# EasyEDA Pro project RYDAPLink.epro

# Schematic RY-DAP_SCH
Create Date: 2022-08-28; Page Name: P1; Project Name: RY-DAP-online; Schematic Name: RY-DAP_SCH; Update Date: 2023-03-11; Add into BOM: yes; Convert to PCB: yes
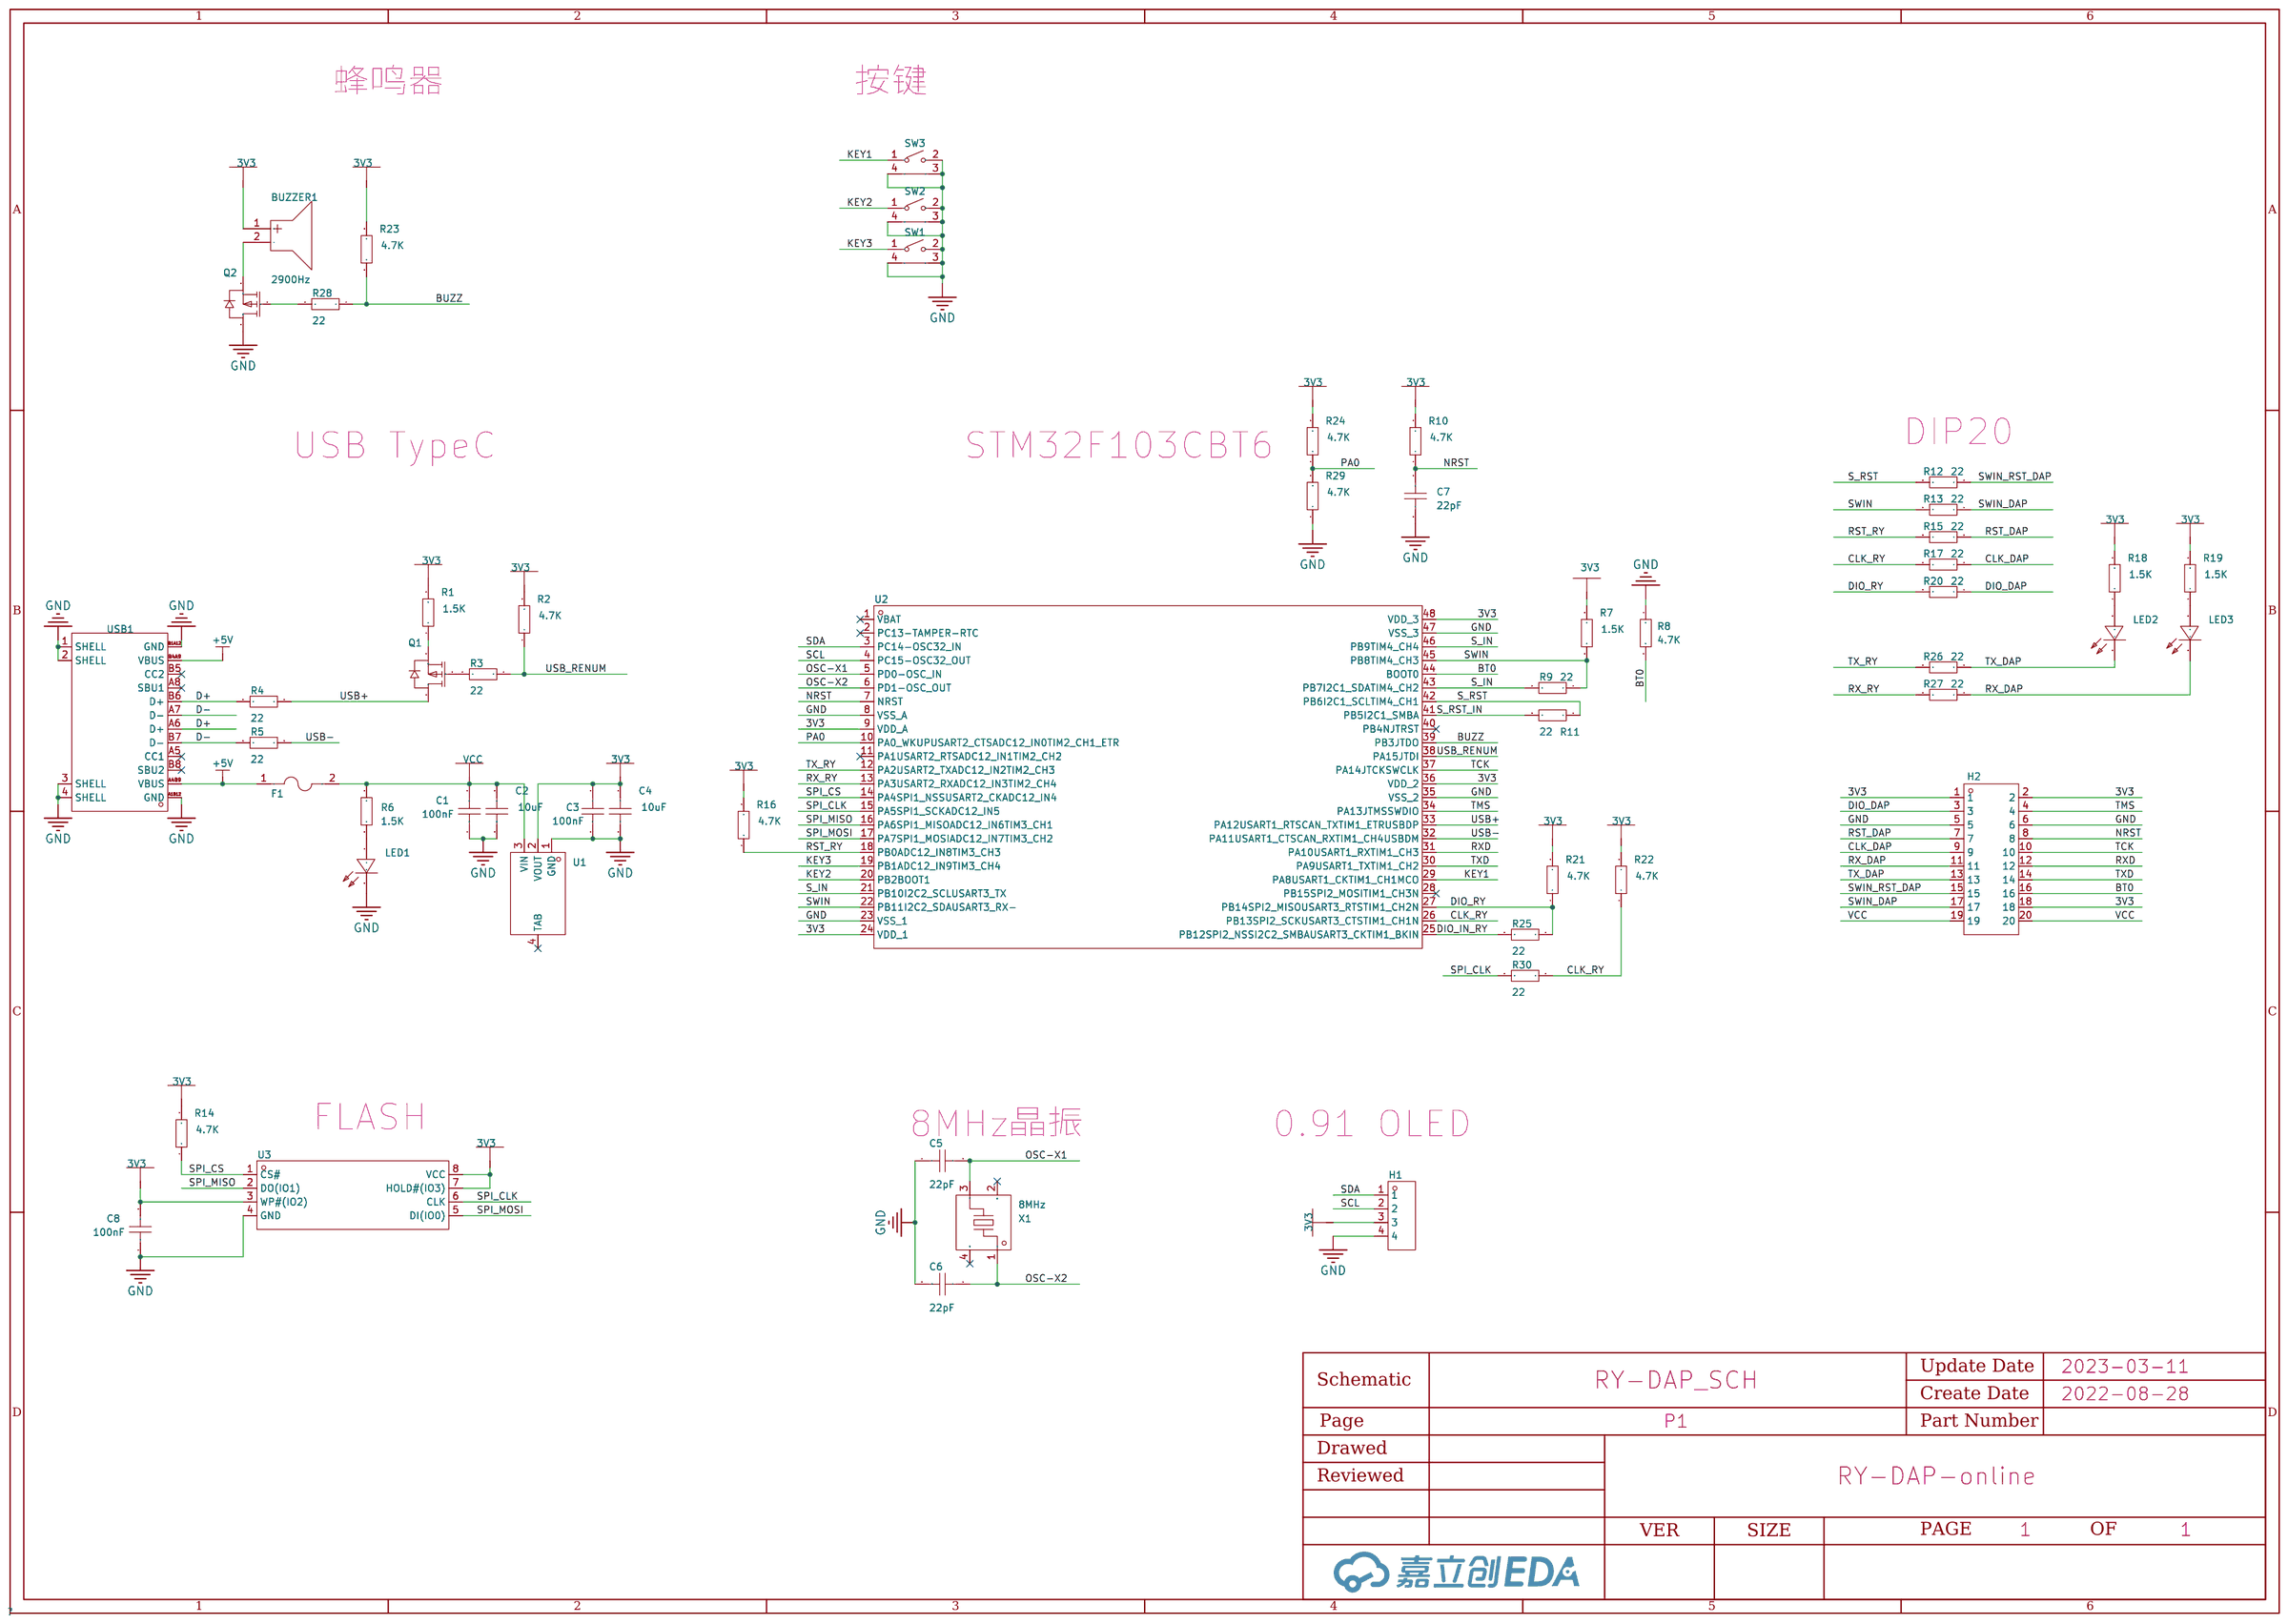
[diagram p0: schematic sheet]

## Parts
BUZZER1  2900Hz  [BUZ-TH_BD9.6-P5.00-D0.7-FD]
C1  100nF  [C0603]
C2  10uF  [C0805]
C3  100nF  [C0603]
C4  10uF  [C0805]
C5  22pF  [C0603]
C6  22pF  [C0603]
C7  22pF  [C0603]
C8  100nF  [C0603]
F1  -  [F0805]
H1  -  [HDR-TH_4P-P2.54-V-M]
H2  -  [HDR-TH_20P-P2.54-V-M-R2-C10-S2.54]
LED1  -  [LED0603-R-RD_RED]
LED2  -  [LED0603-R-RD_RED]
LED3  -  [LED0603-R-RD_RED]
Q1  -  [SOT-23-3_L2.9-W1.4-P1.90-LS2.6-BR]
Q2  -  [SOT-23-3_L2.9-W1.4-P1.90-LS2.6-BR]
R1  1.5K  [R0603]
R2  4.7K  [R0603]
R3  22  [R0603]
R4  22  [R0603]
R5  22  [R0603]
R6  1.5K  [R0603]
R7  1.5K  [R0603]
R8  4.7K  [R0603]
R9  22  [R0603]
R10  4.7K  [R0603]
R11  22  [R0603]
R12  22  [R0603]
R13  22  [R0603]
R14  4.7K  [R0603]
R15  22  [R0603]
R16  4.7K  [R0603]
R17  22  [R0603]
R18  1.5K  [R0603]
R19  1.5K  [R0603]
R20  22  [R0603]
R21  4.7K  [R0603]
R22  4.7K  [R0603]
R23  4.7K  [R0603]
R24  4.7K  [R0603]
R25  22  [R0603]
R26  22  [R0603]
R27  22  [R0603]
R28  22  [R0603]
R29  4.7K  [R0603]
R30  22  [R0603]
SW1  -  [SW-SMD_TS-1012A-AC05026]
SW2  -  [SW-SMD_TS-1012A-AC05026]
SW3  -  [SW-SMD_TS-1012A-AC05026]
U1  -  [SOT-223-3_L6.5-W3.4-P2.30-LS7.0-BR]
U2  -  [LQFP-48_L7.0-W7.0-P0.50-LS9.0-BL]
U3  -  [SOIC-8_L5.3-W5.3-P1.27-LS8.0-BL]
USB1  -  [USB-C-SMD_G-SWITCH_GT-USB-7010EN]
X1  8MHz  [CRYSTAL-SMD_4P-L3.2-W2.5-BL]

## Library data of the parts
BUZZER1 = Cy-9650-3029: 驱动方式:有源(内含驱动线路);构造类型:电磁式;额定电压:3V;工作电压:2V~4V;频率:2900Hz;声压(SPL):85dB@3V,10cm;直径(φD):9.6mm;高度:5.2mm;; LCSC Part Name: 电磁式有源蜂鸣器; Supplier Part: C200212; Manufacturer: CY(超音); Supplier Footprint: 插件; JLCPCB Part Class: Extended Part; Datasheet: https://atta.szlcsc.com/upload/public/pdf/source/20180420/C200212_F1CED36530D3A11649FCF5A8082FE34C.pdf; Supplier: LCSC; Oscillator Circuit: 有源(内含驱动线路); Technology Type: 电磁式; Rated Voltage: 3V; Operating Voltage: 2V~4V; Sound Pressure Level (SPL): 85dB@3V,10cm; Diameter (φD): 9.6mm; Height: 5.2mm
C1 C3 C8 = CC0603KRX7R9BB104: 容值:100nF;精度:±10%;额定电压:50V;温度系数:X7R;; LCSC Part Name: 100nF ±10% 50V; Supplier Part: C14663; Manufacturer: YAGEO(国巨); Supplier Footprint: 0603; JLCPCB Part Class: Basic Part; Datasheet: https://atta.szlcsc.com/upload/public/pdf/source/20170116/1484561234239.pdf; Supplier: LCSC; Tolerance: ±10%; Voltage Rated: 50V; Temperature Coefficient: X7R
C2 C4-C7 = CC0805FRNPO9BN330: 容值:33pF;精度:±1%;额定电压:50V;温度系数:NP0;; LCSC Part Name: 33pF ±1% 50V; Supplier Part: C541516; Manufacturer: YAGEO(国巨); Supplier Footprint: 0805; JLCPCB Part Class: Extended Part; Datasheet: https://atta.szlcsc.com/upload/public/pdf/source/20200615/C541516_87B4F5CEA473EFDDBB2B4786DAFFF3AA.pdf; Supplier: LCSC; Tolerance: ±1%; Voltage Rated: 50V; Temperature Coefficient: NP0
F1 = ASMD0805-075: 最大电压:6V;最大电流:40A;保持电流:750mA;跳闸电流:1.5A;消耗功率:600mW;初始态阻值(最小值):90mΩ;跳断后阻值(最大值):385mΩ;最大动作时间:200ms;工作温度:-40~+85;; LCSC Part Name: 0.75A 自恢复; Supplier Part: C135330; Manufacturer: JDTfuse集电通; Supplier Footprint: 0805; JLCPCB Part Class: Extended Part; Datasheet: https://atta.szlcsc.com/upload/public/pdf/source/20171014/C135330_15079756464341038401.pdf; Supplier: LCSC; Operating Voltage (Max): 6V; Current Rating (Max): 40A; Hold Current: 750mA; Trip Current: 1.5A; Power Dissipation: 600mW; Resistance - Initial (Ri) (Min): 90mΩ; Resistance - Post Trip (R1) (Max): 385mΩ; Maximum Time to Trip: 200ms; Operating Temperature: -40~+85
H1 = KH-2.54PH180-1X4P-L11.5: 间距:2.54mm;总PIN位数:4;排数:1;插针结构:1x4P;行距:-;安装类型:直插;圆针/方针:方针;额定电流:3A;额定电压:-;配合针长度:6mm;塑高:2.5mm;端接针长度:3mm;触头材质:-;工作温度范围:-40~+105;颜色:黑色;; LCSC Part Name: 2.54mm 1x4P; Supplier Part: C2905435; Manufacturer: kinghelm(金航标); Supplier Footprint: 插件,P=2.54mm; JLCPCB Part Class: Extended Part; Datasheet: https://atta.szlcsc.com/upload/public/pdf/source/20211019/06FD9EA041E66F176E900F61FE678D35.pdf; Supplier: LCSC; Pitch: 2.54mm; Number of Pins: 4; Number of Rows: 1; Pin Structure: 1x4P; Mounting Type: 直插; Circluar Pins/Square Pins: 方针; Current Rating (Max): 3A; Length of Mating Pin: 6mm; Insulation Height: 2.5mm; Length of End Connection Pin: 3mm; Operating Temperature Range: -40~+105; Color: 黑色
H2 = 1125-1210G0S120C002: 间距:2.54mm;总PIN位数:20;排数:2;插针结构:2x10P;行距:2.54mm;安装类型:直插;圆针/方针:方针;额定电流:3A;额定电压:-;配合针长度:-;塑高:2.5mm;端接针长度:-;工作温度范围:-40~+105;颜色:黑色;; LCSC Part Name: 2x10P 间距P=2.54mm; Supplier Part: C920775; Manufacturer: Wcon(维峰电子); Supplier Footprint: 插件,P=2.54mm; Datasheet: https://atta.szlcsc.com/upload/public/pdf/source/20211202/DE12C641305AA727218726D917D75D7F.pdf; Supplier: LCSC; Pitch: 2.54mm; Number of Pins: 20; Number of Rows: 2; Pin Structure: 2x10P; Row Spacing: 2.54mm; Mounting Type: 直插; Circluar Pins/Square Pins: 方针; Current Rating (Max): 3A; Insulation Height: 2.5mm; Operating Temperature Range: -40~+105; Color: 黑色
LED1-LED3 = NCD0603R3: 尺寸1.6x0.8x0.8；IF=20ma：1.6~2.6v，620~640nm,51~150mcd金线，光强高，功耗低，可靠性好，寿命长; LCSC Part Name: 红色;贴片LED;0603红灯;; Supplier Part: C3151730; Manufacturer: 国星光电; Supplier Footprint: 0603; JLCPCB Part Class: Extended Part; Datasheet: https://atta.szlcsc.com/upload/public/pdf/source/20220704/CBFF28C1847A97213A75929E60B7DDE7.pdf; Supplier: LCSC
Q1 Q2 = AO3401: 类型:-;漏源电压(Vdss):-;连续漏极电流(Id):-;功率(Pd):-;导通电阻(RDS(on)@Vgs,Id):-;阈值电压(Vgs(th)@Id):-;栅极电荷(Qg@Vgs):-;输入电容(Ciss@Vds):-;反向传输电容(Crss@Vds):-;; Supplier Part: C727156; Manufacturer: TWGMC(台湾迪嘉); Supplier Footprint: SOT-23; JLCPCB Part Class: Extended Part; Datasheet: https://atta.szlcsc.com/upload/public/pdf/source/20200827/C727156_6E081BBEEFBC6B8FEE164CB196B0AF30.pdf; Supplier: LCSC
R1-R30 = TR0603B10K0P0525Z: 电阻类型:薄膜电阻;阻值:10kΩ;精度:±0.1%;功率:100mW;温度系数:±25ppm/;最大工作电压:75V;工作温度范围:-55~+155;; LCSC Part Name: 10kΩ ±0.1% 100mW; Supplier Part: C188363; Manufacturer: EVER OHMS(天二科技); Supplier Footprint: 0603; JLCPCB Part Class: Extended Part; Datasheet: https://atta.szlcsc.com/upload/public/pdf/source/20190415/C188363_433BF05B6FB8F7A0F5F35A3E4390C55A.pdf; Supplier: LCSC; Type: 薄膜电阻; Tolerance: ±0.1%; Power(Watts): 100mW; Temperature Coefficient: ±25ppm/; Overload Voltage (Max): 75V; Operating Temperature Range: -55~+155
SW1-SW3 = TS-1012A-AC05026: 触点电流:50mA;额定电压(DC):12V;绝缘电阻:100MΩ;电路结构:单刀单掷;安装方式:卧贴;按钮形状:矩形按钮;按钮/盖帽颜色:白色;作用力:260gf@±50gf;机械寿命:50000;工作温度:-30~+80;引脚样式:SMD接片;开关长度:6mm;开关宽度:3.6mm;开关高度:5mm;带支架:否;; LCSC Part Name: 365.0 260gf 侧按轻触开关; Supplier Part: C720456; Manufacturer: XUNPU(讯普); Supplier Footprint: SMD; JLCPCB Part Class: Extended Part; Datasheet: https://atta.szlcsc.com/upload/public/pdf/source/20200810/C720456_D958E12D1FC8757B1EE5C4C24011CAC5.pdf; Supplier: LCSC; Contact Current: 50mA; Voltage Rating (DC): 12V; Insulation Resistance: 100MΩ; Circuit: 单刀单掷; Mounting Style: 卧贴; Actuator Style: 矩形按钮; Actuator/Cap Color: 白色; Operating Force: 260gf@±50gf; Mechanical Life: 50000; Operating Temperature: -30~+80; Pin Style: SMD接片; Switch Length: 6mm; Switch Width: 3.6mm; Switch Height: 5mm; Strike Gundam: 否
U1 = AMS1117-3.3: 输出类型:固定;输出极性:正;输出通道数:1;最大输入电压:18V;输出电压:3.3V;压差:1.4V@(1A);输出电流:800mA;电源纹波抑制比(PRSS):-;; LCSC Part Name: Vin=18V Vout=3.3V 800mA; Supplier Part: C351784; Manufacturer: PUOLOP(迪浦); Supplier Footprint: SOT-223; JLCPCB Part Class: Extended Part; Datasheet: https://atta.szlcsc.com/upload/public/pdf/source/20210915/EA806799CEEC3F52E0A4FA8303A508AC.pdf; Supplier: LCSC; Output Type: 固定; Output Polarity: 正; Number of Outputs: 1; Maximum Input Voltage: 18V; Output Voltage: 3.3V; Dropout Voltage: 1.4V@(1A); Output Current: 800mA
U2 = STM32F103CBT6: 主频（MAX):72MHz;工作电压:2V ~ 3.6V;; Supplier Part: C8304; Manufacturer: ST(意法半导体); Supplier Footprint: LQFP-48_7x7x05P; JLCPCB Part Class: Extended Part; Datasheet: https://atta.szlcsc.com/upload/public/pdf/source/20140724/1457707170379.pdf; Supplier: LCSC; Speed: 72MHz; Voltage - Supply (Vcc/Vdd): 2V ~ 3.6V; RAM Size: 20KB; Number of I/O: 37; A/D: 16x12bit; PWM: 13; UART/USART: 3 USART; I2C（SMBUS/PMBUS）: 2; USB Device: 1; CAN: 1
U3 = W25Q64FVSSIQ: Supplier Part: C2943203; Manufacturer: WINBOND(华邦); Supplier Footprint: SOIC-8; JLCPCB Part Class: Extended Part; Datasheet: https://atta.szlcsc.com/upload/public/pdf/source/20220124/B586DF8D2E26F9242C002B2D869830EA.pdf; Supplier: LCSC
USB1 = HC-TYPE-C-16P-01A-R: 连接器类型:Type-C;公母:母座;触点数量:16;端口数量:1;安装方式:卧贴;; LCSC Part Name: Type-C 母座 卧贴; Supplier Part: C2997433; Manufacturer: HCTL(华灿天禄); Supplier Footprint: SMD; Datasheet: https://atta.szlcsc.com/upload/public/pdf/source/20220415/23B51DCADC5F28223C40C3605487ACA1.pdf; Supplier: LCSC; Connector Type: Type-C; Gender: 母座; Number of Contacts: 16; Number of Ports: 1; Mounting Style: 卧贴
X1 = C3SB8.000F20E12: 晶振类型:-;频率:-;频率公差:-;频率稳定度:-;负载电容:-;工作温度:-;; LCSC Part Name: SMD3225 8MHz 20pF ±10ppm; Supplier Part: C1122371; Manufacturer: 川晶科技; Supplier Footprint: SMD3225-4P; JLCPCB Part Class: Extended Part; Datasheet: https://atta.szlcsc.com/upload/public/pdf/source/20201223/C1122371_97DFC19ADA5624E5F21B86C96BD1463C.pdf; Supplier: LCSC

## Nets
3V3: BUZZER1.1(+) C3.1 C4.2 C8.2 H1.3 H2.1 H2.2 H2.18 R1.2 R2.2 R7.2 R10.2 R14.2 R16.2 R18.2 R19.2 R21.2 R22.2 R23.2 R24.2 U1.2(VOUT) U2.9(VDD_A) U2.24(VDD_1) U2.36(VDD_2) U2.48(VDD_3) U3.3(WP#(IO2)) U3.7(HOLD#(IO3)) U3.8(VCC)
+5V: F1.1 USB1.A4B9(VBUS) USB1.B4A9(VBUS)
GND: C1.1 C2.1 C3.2 C4.1 C5.1 C6.2 C7.2 C8.1 H1.4 H2.5 H2.6 LED1.2(K) Q2.3(D) R8.1 R29.1 SW1.2 SW1.3 SW1.4 SW2.2 SW2.3 SW2.4 SW3.2 SW3.3 SW3.4 U1.1(GND) U2.8(VSS_A) U2.23(VSS_1) U2.35(VSS_2) U2.47(VSS_3) U3.4(GND) USB1.1(SHELL) USB1.2(SHELL) USB1.3(SHELL) USB1.4(SHELL) USB1.A1B12(GND) USB1.B1A12(GND)
VCC: C1.2 C2.2 F1.2 H2.19 H2.20 R6.1 U1.3(VIN)
BT0: H2.16 R8.2 U2.44(BOOT0)
BUZZ: R23.1 R28.1 U2.39(PB3JTDO)
CLK_DAP: H2.9 R17.1
CLK_RY: R17.2 R22.1 R30.1 U2.26(PB13SPI2_SCKUSART3_CTSTIM1_CH1N)
D+: R4.2 USB1.A6(D+) USB1.B6(D+)
D-: R5.2 USB1.A7(D-) USB1.B7(D-)
DIO_DAP: H2.3 R20.1
DIO_IN_RY: R25.2 U2.25(PB12SPI2_NSSI2C2_SMBAUSART3_CKTIM1_BKIN)
DIO_RY: R20.2 R21.1 R25.1 U2.27(PB14SPI2_MISOUSART3_RTSTIM1_CH2N)
KEY1: SW3.1 U2.29(PA8USART1_CKTIM1_CH1MCO)
KEY2: SW2.1 U2.20(PB2BOOT1)
KEY3: SW1.1 U2.19(PB1ADC12_IN9TIM3_CH4)
NRST: C7.1 H2.8 R10.1 U2.7(NRST)
OSC-X1: C5.2 U2.5(PD0-OSC_IN) X1.3
OSC-X2: C6.1 U2.6(PD1-OSC_OUT) X1.1
PA0: R24.1 R29.2 U2.10(PA0_WKUPUSART2_CTSADC12_IN0TIM2_CH1_ETR)
RST_DAP: H2.7 R15.1
RST_RY: R15.2 R16.1 U2.18(PB0ADC12_IN8TIM3_CH3)
RX_DAP: H2.11 LED3.2(K) R27.1
RX_RY: R27.2 U2.13(PA3USART2_RXADC12_IN3TIM2_CH4)
RXD: H2.12 U2.31(PA10USART1_RXTIM1_CH3)
S_IN: R9.2 U2.21(PB10I2C2_SCLUSART3_TX) U2.43(PB7I2C1_SDATIM4_CH2) U2.46(PB9TIM4_CH4)
S_RST: R11.1 R12.2 U2.42(PB6I2C1_SCLTIM4_CH1)
S_RST_IN: R11.2 U2.41(PB5I2C1_SMBA)
SCL: H1.2 U2.4(PC15-OSC32_OUT)
SDA: H1.1 U2.3(PC14-OSC32_IN)
SPI_CLK: R30.2 U2.15(PA5SPI1_SCKADC12_IN5) U3.6(CLK)
SPI_CS: R14.1 U2.14(PA4SPI1_NSSUSART2_CKADC12_IN4) U3.1(CS#)
SPI_MISO: U2.16(PA6SPI1_MISOADC12_IN6TIM3_CH1) U3.2(DO(IO1))
SPI_MOSI: U2.17(PA7SPI1_MOSIADC12_IN7TIM3_CH2) U3.5(DI(IO0))
SWIN: R7.1 R9.1 R13.2 U2.22(PB11I2C2_SDAUSART3_RX-) U2.45(PB8TIM4_CH3)
SWIN_DAP: H2.17 R13.1
SWIN_RST_DAP: H2.15 R12.1
TCK: H2.10 U2.37(PA14JTCKSWCLK)
TMS: H2.4 U2.34(PA13JTMSSWDIO)
TX_DAP: H2.13 LED2.2(K) R26.1
TX_RY: R26.2 U2.12(PA2USART2_TXADC12_IN2TIM2_CH3)
TXD: H2.14 U2.30(PA9USART1_TXTIM1_CH2)
USB+: Q1.3(D) R4.1 U2.33(PA12USART1_RTSCAN_TXTIM1_ETRUSBDP)
USB-: R5.1 U2.32(PA11USART1_CTSCAN_RXTIM1_CH4USBDM)
USB_RENUM: R2.1 R3.1 U2.38(PA15JTDI)
$1N17432: Q2.1(G) R28.2
$1N18058: BUZZER1.2(-) Q2.2(S)
$1N29748: Q1.1(G) R3.2
$1N30353: LED1.1(A) R6.2
$1N32779: LED2.1(A) R18.1
$1N32941: LED3.1(A) R19.1
$1N52771: Q1.2(S) R1.1

Not connected (* = marked no-connect by the designer): U1 4(TAB)*; U2 1(VBAT)* 2(PC13-TAMPER-RTC)* 11(PA1USART2_RTSADC12_IN1TIM2_CH2)* 28(PB15SPI2_MOSITIM1_CH3N)* 40(PB4NJTRST)*; USB1 A5(CC1)* A8(SBU1)* B5(CC2)* B8(SBU2)*; X1 2(GND)* 4(GND)*

## Notes on the sheet
- 蜂鸣器
- 按键
- DIP20
- USB TypeC
- STM32F103CBT6
- FLASH
- 8MHz晶振
- 0.91 OLED

# Board RY-DAP_PCB
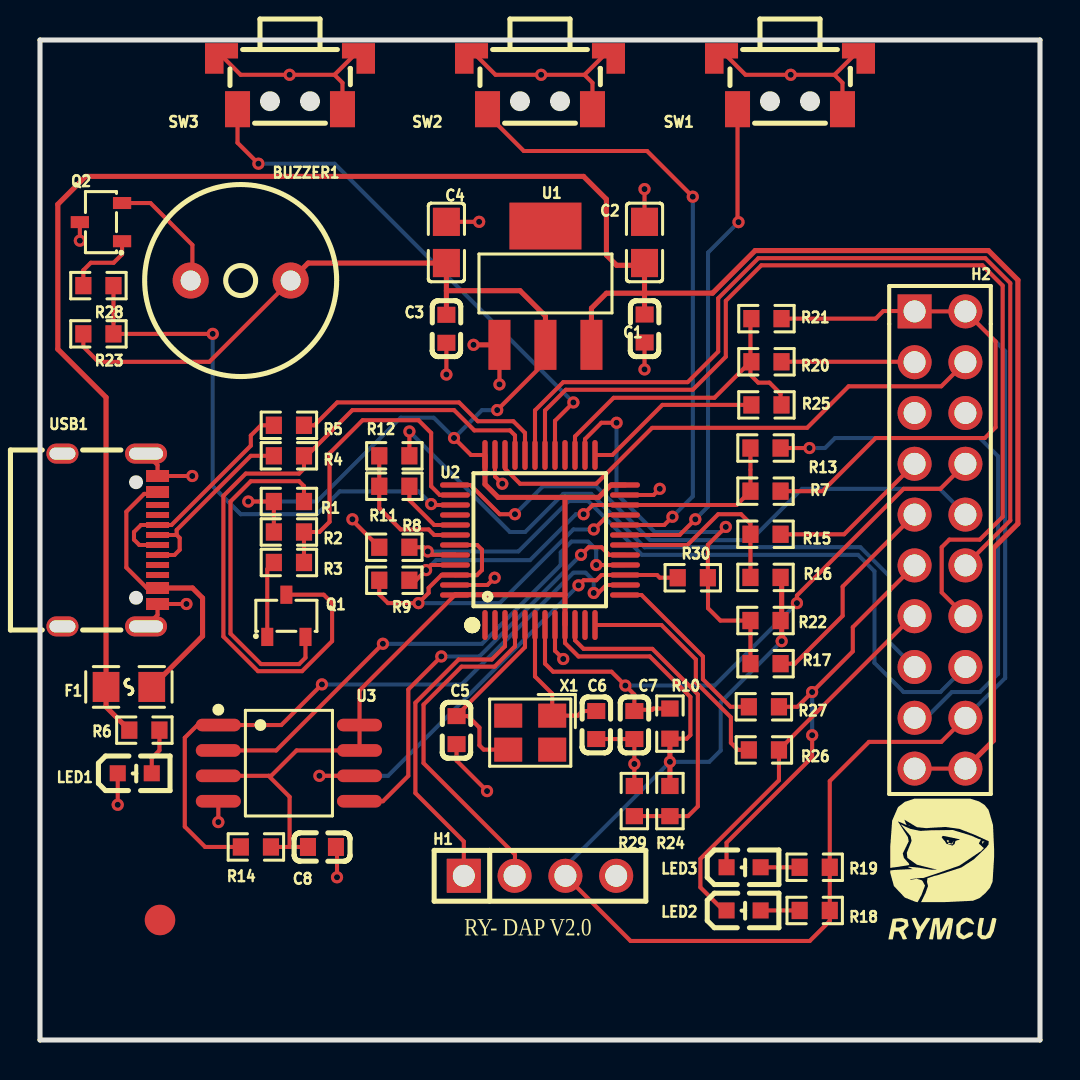
[diagram p1: board, top side]
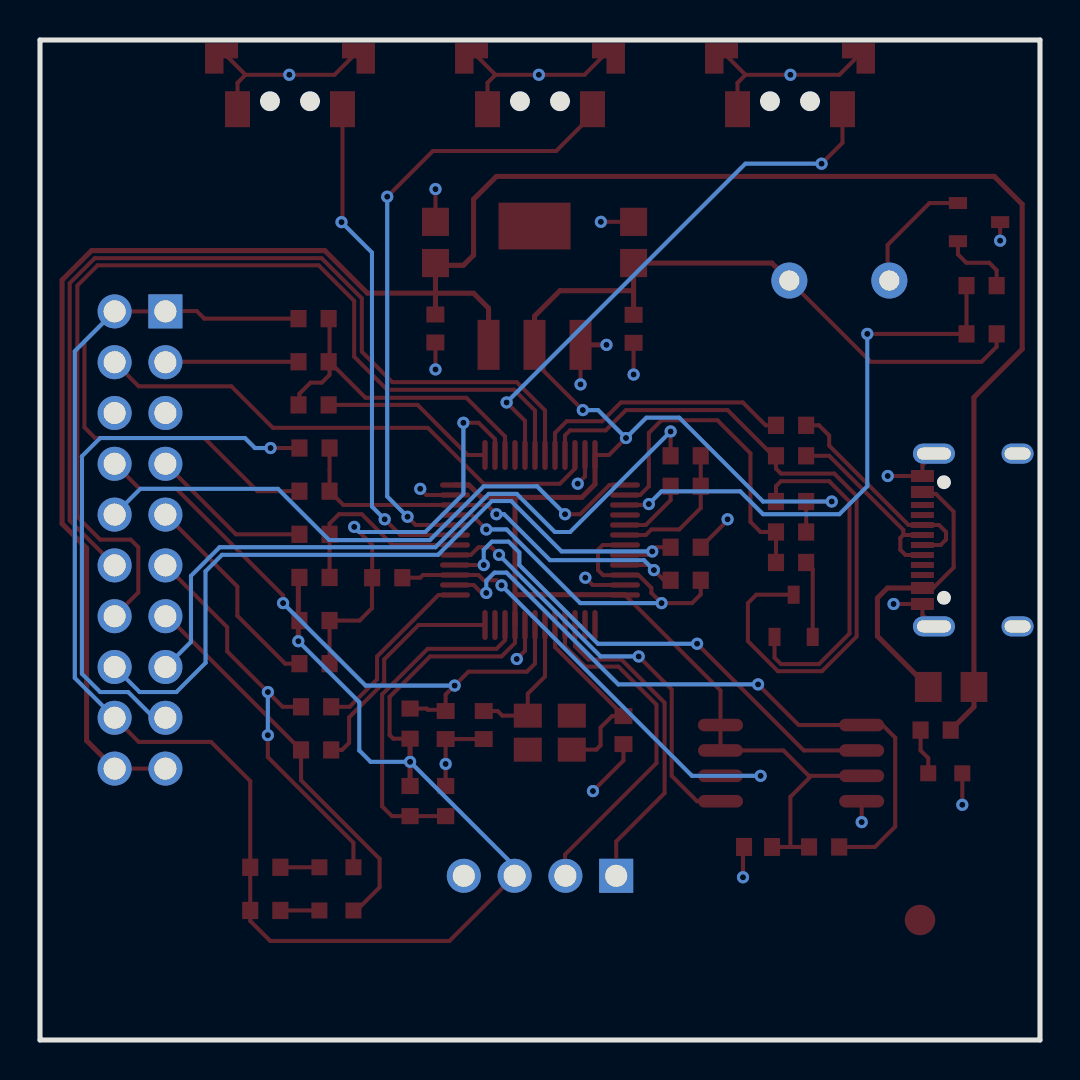
[diagram p2: board, bottom side, seen from below]

Outline 50 x 50 mm; copper layers: Top Layer, Bottom Layer. Coordinates in mm from the lower left corner of the outline.
Outline path: 0,50 0,0 50,0 50,50 0,50
Stack: Top Layer 0.035mm / Dielectric1 1.51mm FR4 er 4.5 / Bottom Layer 0.035mm

## Design rules (mm)
spacing safeClearance (default): track to track 0.152, other pairs 0.147 to 0.3
track width trackWidth (default): min 0.127, default 0.203, max 2.54
differential pair differentialPair (default): width min 0.127, default 0.254, max 2.54; gap min 0.152, default 0.152
via viaSize (default): diameter min 0.5, default 0.61, max 10; hole min 0.3, default 0.305, max 6

## Placement (name value [footprint] x y rotation side)
BUZZER1  2900Hz  [BUZ-TH_BD9.6-P5.00-D0.7-FD]  10.03 37.97 180 top
C1  100nF  [C0603]  30.23 35.58 90 top
C2  10uF  [C0805]  30.23 39.88 270 top
C3  100nF  [C0603]  20.32 35.56 270 top
C4  10uF  [C0805]  20.32 39.88 270 top
C5  22pF  [C0603]  20.83 15.49 90 top
C6  22pF  [C0603]  27.81 15.75 270 top
C7  22pF  [C0603]  29.72 15.75 270 top
C8  100nF  [C0603]  14.1 9.65 180 top
F1  -  [F0805]  4.44 17.65 180 top
H1  -  [HDR-TH_4P-P2.54-V-M]  25 8.21 0 top
H2  -  [HDR-TH_20P-P2.54-V-M-R2-C10-S2.54]  45 25 270 top
LED1  -  [LED0603-R-RD_RED]  4.74 13.34 0 top
LED2  -  [LED0603-R-RD_RED]  35.18 6.48 0 top
LED3  -  [LED0603-R-RD_RED]  35.18 8.64 0 top
NOREF  -  [Pad_e1074]  6 6 0 top
Q1  -  [SOT-23-3_L2.9-W1.4-P1.90-LS2.6-BR]  12.32 21.21 270 top
Q2  -  [SOT-23-3_L2.9-W1.4-P1.90-LS2.6-BR]  3.05 40.89 0 top
R1  1.5K  [R0603]  12.45 26.92 180 top
R2  4.7K  [R0603]  12.45 25.4 180 top
R3  22  [R0603]  12.45 23.88 180 top
R4  22  [R0603]  12.45 29.21 180 top
R5  22  [R0603]  12.45 30.73 180 top
R6  1.5K  [R0603]  5.22 15.49 0 top
R7  1.5K  [R0603]  36.28 27.44 0 top
R8  4.7K  [R0603]  17.72 24.64 0 top
R9  22  [R0603]  17.72 22.99 180 top
R10  4.7K  [R0603]  31.5 15.82 270 top
R11  22  [R0603]  17.72 27.69 0 top
R12  22  [R0603]  17.72 29.21 180 top
R13  22  [R0603]  36.28 29.6 180 top
R14  4.7K  [R0603]  10.8 9.65 0 top
R15  22  [R0603]  36.28 25.29 180 top
R16  4.7K  [R0603]  36.28 23.13 0 top
R17  22  [R0603]  36.28 18.82 180 top
R18  1.5K  [R0603]  38.74 6.48 0 top
R19  1.5K  [R0603]  38.74 8.64 0 top
R20  22  [R0603]  36.32 33.91 180 top
R21  4.7K  [R0603]  36.32 36.07 0 top
R22  4.7K  [R0603]  36.28 20.97 0 top
R23  4.7K  [R0603]  2.92 35.31 180 top
R24  4.7K  [R0603]  31.5 11.95 90 top
R25  22  [R0603]  36.32 31.76 180 top
R26  22  [R0603]  36.19 14.5 180 top
R27  22  [R0603]  36.19 16.66 180 top
R28  22  [R0603]  2.92 37.72 180 top
R29  4.7K  [R0603]  29.72 11.95 270 top
R30  22  [R0603]  32.64 23.11 180 top
SW1  -  [SW-SMD_TS-1012A-AC05026]  37.5 48 0 top
SW2  -  [SW-SMD_TS-1012A-AC05026]  25 48 0 top
SW3  -  [SW-SMD_TS-1012A-AC05026]  12.5 48 0 top
U1  -  [SOT-223-3_L6.5-W3.4-P2.30-LS7.0-BR]  25.27 37.73 270 top
U2  -  [LQFP-48_L7.0-W7.0-P0.50-LS9.0-BL]  25 25 0 top
U3  -  [SOIC-8_L5.3-W5.3-P1.27-LS8.0-BL]  12.45 13.84 270 top
USB1  -  [USB-C-SMD_G-SWITCH_GT-USB-7010EN]  3.5 25 270 top
X1  8MHz  [CRYSTAL-SMD_4P-L3.2-W2.5-BL]  24.51 15.37 180 top

## Footprints (pads in the part's own frame, mm; a bottom-side part is the same pattern mirrored in y, then rotated)
BUZ-TH_BD9.6-P5.00-D0.7-FD
  round 1.801 hole 1.001: 1(-2.499,0) 2(2.499,0)
C0603
  rect 0.8x0.9 smd: 1(-0.7,0) 2(0.7,0)
C0805
  rect 1.41x1.35 smd: 1(-1.03,0) 2(1.03,0)
CRYSTAL-SMD_4P-L3.2-W2.5-BL
  rect 1.4x1.2 smd: 1(-1.1,-0.85) 2(1.1,-0.85) 3(1.1,0.85) 4(-1.1,0.85)
F0805
  rect 1.335x1.5 smd: 1(-1.143,0) 2(1.143,0)
HDR-TH_4P-P2.54-V-M
  rect 1.7x1.7 hole 1.1: 1(-3.81,0)
  round 1.7 hole 1.1: 2(-1.27,0) 3(1.27,0) 4(3.81,0)
HDR-TH_20P-P2.54-V-M-R2-C10-S2.54
  rect 1.7x1.7 hole 1.1: 1(-11.43,-1.27)
  round 1.7 hole 1.1: 2(-11.43,1.27) 3(-8.89,-1.27) 4(-8.89,1.27) 5(-6.35,-1.27) 6(-6.35,1.27) 7(-3.81,-1.27) 8(-3.81,1.27) 9(-1.27,-1.27) 10(-1.27,1.27) 11(1.27,-1.27) 12(1.27,1.27) 13(3.81,-1.27) 14(3.81,1.27) 15(6.35,-1.27) 16(6.35,1.27) 17(8.89,-1.27) 18(8.89,1.27) 19(11.43,-1.27) 20(11.43,1.27)
LED0603-R-RD_RED
  rect 0.8x0.8 smd: 1(0.851,0) 2(-0.851,0)
LQFP-48_L7.0-W7.0-P0.50-LS9.0-BL
  oval 0.27x1.5 smd: 1(-2.75,-4.25) 2(-2.25,-4.25) 3(-1.75,-4.25) 4(-1.25,-4.25) 5(-0.75,-4.25) 6(-0.25,-4.25) 7(0.25,-4.25) 8(0.75,-4.25) 9(1.25,-4.25) 10(1.75,-4.25) 11(2.25,-4.25) 12(2.75,-4.25) 25(2.75,4.25) 26(2.25,4.25) 27(1.75,4.25) 28(1.25,4.25) 29(0.75,4.25) 30(0.25,4.25) 31(-0.25,4.25) 32(-0.75,4.25) 33(-1.25,4.25) 34(-1.75,4.25) 35(-2.25,4.25) 36(-2.75,4.25)
  oval 1.5x0.27 smd: 13(4.25,-2.75) 14(4.25,-2.25) 15(4.25,-1.75) 16(4.25,-1.25) 17(4.25,-0.75) 18(4.25,-0.25) 19(4.25,0.25) 20(4.25,0.75) 21(4.25,1.25) 22(4.25,1.75) 23(4.25,2.25) 24(4.25,2.75) 37(-4.25,2.75) 38(-4.25,2.25) 39(-4.25,1.75) 40(-4.25,1.25) 41(-4.25,0.75) 42(-4.25,0.25) 43(-4.25,-0.25) 44(-4.25,-0.75) 45(-4.25,-1.25) 46(-4.25,-1.75) 47(-4.25,-2.25) 48(-4.25,-2.75)
Pad_e1074
  round 1.524 smd: 1(0,0)
R0603
  rect 0.806x0.864 smd: 1(-0.753,0) 2(0.753,0)
SOIC-8_L5.3-W5.3-P1.27-LS8.0-BL
  oval 0.63x2.25 smd: 1(-1.905,-3.53) 2(-0.635,-3.53) 3(0.635,-3.53) 4(1.905,-3.53) 5(1.905,3.53) 6(0.635,3.53) 7(-0.635,3.53) 8(-1.905,3.53)
SOT-23-3_L2.9-W1.4-P1.90-LS2.6-BR
  rect 0.91x0.6 smd: 1(1.055,-0.955) 2(1.055,0.955) 3(-1.055,0)
SOT-223-3_L6.5-W3.4-P2.30-LS7.0-BR
  rect 2.5x1.1 smd: 1(2.97,-2.3) 2(2.97,0) 3(2.97,2.3)
  rect 2.34x3.6 smd: 4(-2.97,0)
SW-SMD_TS-1012A-AC05026
  rect 1.25x1.801 smd: 1(-2.624,-1.46) 2(2.624,-1.46)
  custom 1.651x1.524 smd: 3(3.424,1.46) 4(-3.424,1.46)
USB-C-SMD_G-SWITCH_GT-USB-7010EN
  oval 1x2.1 hole 0.6x1.7: 1(-4.32,1.802) 2(4.32,1.802)
  oval 1x1.6 hole 0.6x1.3: 3(4.32,-2.377) 4(-4.32,-2.377)
  rect 0.6x1.15 smd: A1B12(-3.2,2.377) A4B9(-2.4,2.377) B1A12(3.2,2.377) B4A9(2.4,2.377)
  rect 0.3x1.15 smd: A5(-1.25,2.377) A6(-0.25,2.377) A7(0.25,2.377) A8(1.25,2.377) B5(1.75,2.377) B6(0.75,2.377) B7(-0.75,2.377) B8(-1.75,2.377)

## Nets
As in the schematic.

Pads without a net: NOREF 1; U1 4; U2 1 2 11 28 40; USB1 A5 A8 B5 B8; X1 2 4

## Via types
v1: diameter 0.61, hole 0.305, Top Layer to Bottom Layer, 57 vias

## Routing (per net, layer and track width the routed paths; a pad name or vN(x,y) marks a point on that pad's centre or on a via; arc(x,y) is an arc through that point)
3V3: length 212.4
  Top Layer w0.203: R10.2 32.34,15.07 32.52,15.25 32.52,17.15 30.5,19.18 26.92,19.18 26.25,19.85 U2.9 ; H2.18 45.06,14.91 41.45,14.91 39.49,12.95 R19.2 ; U1.2 25.27,33.91 v1(22.86,31.5) ; 13.34,9.65 12.48,9.65 ; 12.48,9.65 R14.2 ; 12.48,9.65 12.48,12.16 11.43,13.21 ; U3.3 11.43,13.21 ; 11.43,13.21 11.56,13.21 12.83,14.48 U3.7 U3.8 15.98,17.48 U2.48 ; BUZZER1.1 8.47,33.91 2.92,33.91 2.17,34.66 R23.2 ; H2.2 43.73,36.43 43.71,36.45 42.16,36.45 41.78,36.07 R21.2 ; R2.2 R1.2 v1(10.41,26.92) ; 46.27,36.43 47.78,34.93 47.78,30.63 47.24,30.1 41.78,30.1 39.13,27.44 R7.2 ; H1.3 29.53,4.95 38.49,4.95 39.49,5.95 R18.2 39.49,8.51 ; U2.36 21.55,29.25 v1(20.7,30.1)
  Top Layer w0.254: 26.25,27.13 27.93,27.13 28.55,27.75 U2.24 ; 26.25,27.13 22.91,27.13 22.25,27.79 U2.36 ; 26.25,27.13 26.25,22.27 ; U1.2 25.27,36.2 24,37.47 20.33,37.47 20.32,37.45 ; R16.2 37.08,23.07 37.08,20.92 ; 26.25,22.27 20.77,22.27 U2.48 ; 26.25,22.27 U2.9 ; 37.08,20.92 R22.2 ; 37.08,20.92 v1(37.08,19.94) ; R10.2 v1(31.5,13.91) R24.2 ; 20.32,37.45 C3.1 ; 20.32,37.45 C4.2 13.41,38.85 BUZZER1.1
  Bottom Layer w0.203: v1(22.86,31.5) 22.1,31.5 v1(20.7,30.1) 19.69,31.12 18.03,31.12 13.84,26.92 v1(10.41,26.92) ; H2.2 48.26,34.44 48.26,18.1 H2.18 ; v1(37.08,19.94) 34.04,16.89 34.04,14.48 33.47,13.91 v1(31.5,13.91) 26.27,8.68
+5V: length 14.7
  Top Layer w0.203: USB1.A4B9 5.78,27.31 5.21,27.31 4.32,26.42 4.32,23.62 5.34,22.6 USB1.B4A9
  Top Layer w0.254: F1.1 8.13,20.19 8.13,22.1 7.63,22.6 USB1.B4A9
GND: length 66.3
  Top Layer w0.203: C1.1 30.23,34.87 v1(30.23,33.53) ; 9.02,49.28 10.03,48.26 v1(12.48,48.26) 14.72,48.26 ; v1(26.16,19.05) 25.75,19.46 U2.8 ; 27.22,48.26 SW2.3 ; 27.22,48.26 v1(25.06,48.26) 22.78,48.26 SW2.4 ; 27.22,48.26 27.62,47.86 SW2.2 ; v1(23.11,27.81) 22.75,28.18 U2.35 ; USB1.2 5.88,21.26 USB1.B1A12 v1(7.32,21.8) ; 39.72,48.26 v1(37.54,48.26) 35.28,48.26 SW1.4 ; 39.72,48.26 40.12,47.86 SW1.2 ; 39.72,48.26 SW1.3 ; U2.23 30.68,27.25 v1(30.99,27.56) ; LED1.2 v1(3.89,11.76) ; R29.1 v1(29.72,13.8) C7.2 C6.2 ; 14.72,48.26 SW3.3 ; 14.72,48.26 15.12,47.86 SW3.2 ; C3.2 v1(20.32,33.27) ; C4.1 v1(21.96,40.91) ; U3.4 v1(8.92,10.9) ; Q2.3 v1(1.99,39.97) ; U1.1 v1(22.97,32.78) ; v1(22.73,23.11) 22.37,22.75 U2.47 ; USB1.1 5.88,28.75 USB1.A1B12 v1(7.61,28.2) ; v1(15.62,26.04) 15.62,25.98 R8.1 ; 14.85,9.65 v1(14.85,8.14) ; v1(30.23,42.55) C2.1 ; v1(22.35,12.45) 20.83,13.97 C5.1
  Top Layer w0.254: U1.1 v1(21.68,34.76)
VCC: length 116.8
  Top Layer w0.203: 43.73,13.57 H2.20
  Top Layer w0.254: 30.23,37.34 30.23,38.84 ; 30.23,37.34 33.63,37.34 35.76,39.47 47.42,39.47 48.9,38 48.9,25.82 47.67,24.59 47.67,14.97 H2.20 ; 30.23,37.34 30.23,36.28 C1.2 ; 30.23,37.34 30.22,37.34 28.32,37.34 27.57,36.59 U1.3 ; R6.1 3.3,16.66 F1.2 3.3,32.13 0.89,34.54 0.89,41.78 2.29,43.18 27.18,43.18 28.32,42.04 28.32,39.24 28.83,38.74 30.11,38.74 C2.2
BT0: length 37.5
  Top Layer w0.203: U2.44 20.74,24.26 19.56,24.26 19.18,24.64 R8.2
  Bottom Layer w0.203: H2.16 45.02,17.4 43.18,17.4 41.72,18.86 41.72,23.43 40.9,24.26 30.1,24.26 27.41,26.95 26.44,26.95 23.92,24.43 v1(19.39,24.43)
BUZZ: length 28.4
  Top Layer w0.203: U2.39 19.61,26.75 v1(19.56,26.8) ; R28.1 R23.1 v1(8.64,35.31)
  Bottom Layer w0.203: v1(8.64,35.31) 8.64,27.69 10.03,26.29 13.84,26.29 14.99,27.43 18.92,27.43 v1(19.56,26.8)
CLK_DAP: length 10.6
  Top Layer w0.203: R17.1 37.74,18.82 40.13,21.21 40.13,22.67 43.73,26.27
CLK_RY: length 21.6
  Top Layer w0.203: v1(34.29,25.65) 33.39,24.76 R30.1 33.4,23.11 33.4,21.59 34.02,20.97 35.52,20.97 35.52,18.82 ; U2.26 27.25,30.04 28.07,30.86 v1(28.83,30.86)
  Bottom Layer w0.203: v1(28.83,30.86) 28.83,27.31 30.73,25.4 34.04,25.4 v1(34.29,25.65)
D+: length 9.6
  Top Layer w0.203: R4.2 10.54,29.21 6.84,25.5 6.84,25.25 ; 6.84,25.25 6.99,25.1 6.99,24.51 6.72,24.25 USB1.B6 ; 6.84,25.25 USB1.A6
D-: length 11.2
  Top Layer w0.203: R5.2 11.05,30.73 10.54,30.23 10.54,29.72 6.57,25.75 USB1.B7 5.05,25.75 4.7,25.4 4.7,25.02 4.97,24.75 USB1.A7
DIO_DAP: length 6.7
  Top Layer w0.203: 43.73,33.89 43.71,33.91 R20.1
DIO_IN_RY: length 8.8
  Top Layer w0.203: U2.25 28.62,29.25 31.12,31.76 35.52,31.76
DIO_RY: length 16.5
  Top Layer w0.203: 37.03,31.76 37.03,32.31 36.47,32.87 35.91,32.87 35.52,33.26 35.52,33.91 ; 35.52,33.91 35.52,36.07 ; 35.52,33.91 33.72,32.11 28.68,32.11 26.75,30.18 U2.27
KEY1: length 26.9
  Top Layer w0.203: v1(26.67,31.88) 25.75,30.96 U2.29 ; v1(10.92,43.82) 9.88,44.86 SW3.1
  Bottom Layer w0.203: v1(26.67,31.88) 14.73,43.82 v1(10.92,43.82)
KEY2: length 31.2
  Top Layer w0.203: SW2.1 22.38,46.26 24.19,44.45 30.35,44.45 v1(32.64,42.16) ; v1(31.62,26.16) 31.21,25.75 U2.20
  Bottom Layer w0.203: v1(31.62,26.16) 32.64,27.18 v1(32.64,42.16)
KEY3: length 25.3
  Top Layer w0.203: v1(34.93,40.89) 34.88,40.94 SW1.1 ; v1(32.77,26.04) 31.98,25.25 U2.19
  Bottom Layer w0.203: v1(32.77,26.04) 33.4,26.67 33.4,39.37 v1(34.93,40.89)
NRST: length 31.5
  Top Layer w0.203: U2.7 25.25,18.82 25.65,18.42 28.58,18.42 v1(29.27,17.72) 29.72,17.27 C7.1 29.78,16.51 30.61,16.51 30.67,16.57 R10.1 ; H2.8 45.02,27.56 43.18,27.56 37.85,22.23 v1(37.85,21.84)
  Bottom Layer w0.203: v1(29.27,17.72) 33.72,17.72 v1(37.85,21.84)
OSC-X1: length 9.8
  Top Layer w0.203: U2.5 24.25,19.65 20.83,16.22 C5.2 21.4,16.19 21.97,15.62 21.97,14.73 22.19,14.52 X1.3
OSC-X2: length 7.2
  Top Layer w0.203: U2.6 24.75,18.18 25.61,17.32 X1.1 26.89,16.22 27.12,16.45 C6.1
PA0: length 17
  Top Layer w0.203: R29.2 R24.1 32.4,11.19 32.89,11.68 32.89,17.28 30.62,19.56 27.18,19.56 26.75,19.99 U2.10
RST_DAP: length 8.2
  Top Layer w0.203: R15.1 40.21,25.29 43.73,28.81
RST_RY: length 9.8
  Top Layer w0.203: 35.52,23.13 35.52,25.82 35.05,26.29 33.91,26.29 32.37,24.75 U2.18
RX_DAP: length 21
  Top Layer w0.203: 43.73,23.73 40.64,20.64 40.64,19.43 v1(38.61,17.4) 37.87,16.66 R27.1 ; LED3.2 34.33,9.87 38.61,14.15 v1(38.61,15.24)
  Bottom Layer w0.203: 38.61,15.24 v1(38.61,17.4)
RX_RY: length 9.2
  Top Layer w0.203: R27.2 34.52,16.66 33.15,18.03 33.15,19.18 30.07,22.25 U2.13
RXD: length 46.3
  Top Layer w0.203: H2.12 48.51,25.97 48.51,37.84 47.26,39.09 35.92,39.09 33.91,37.08 33.91,34.42 32.39,32.89 26.16,32.89 24.75,31.48 U2.31
S_IN: length 21.5
  Top Layer w0.203: U2.43 21.86,24.75 22.1,24.51 22.1,23.5 21.84,23.24 20.76,23.24 U2.46 20.08,23.25 19.43,22.61 19.43,22.35 v1(18.92,21.84) 17.4,21.84 16.96,22.28 R9.2 ; U2.21 28.41,26.25 v1(27.69,25.53)
  Bottom Layer w0.203: v1(18.92,21.84) 22.99,21.84 26.67,25.53 v1(27.69,25.53)
S_RST: length 7
  Top Layer w0.203: U2.42 19.71,25.25 19.43,25.53 18.03,25.53 16.96,26.6 R11.1 R12.2
S_RST_IN: length 3.5
  Top Layer w0.203: U2.41 19.71,25.75 18.47,26.99 R11.2
SCL: length 17.1
  Top Layer w0.203: U2.4 23.75,19.69 22.73,18.67 21.08,18.67 19.18,16.77 19.18,13.84 23.75,9.27 23.75,8.38
SDA: length 16.4
  Top Layer w0.203: U2.3 23.25,19.69 22.59,19.02 20.93,19.02 18.77,16.87 18.77,12.34 21.19,9.93 H1.1
SPI_CLK: length 24.1
  Top Layer w0.203: U3.6 v1(13.97,13.21) ; v1(26.92,22.73) 27.18,22.99 27.81,22.99 28.08,23.25 U2.15 30.85,23.25 30.99,23.11 R30.2
  Bottom Layer w0.203: v1(26.92,22.73) 17.4,13.21 v1(13.97,13.21)
SPI_CS: length 34
  Top Layer w0.203: v1(14.1,17.78) 12.06,15.75 U3.1 7.87,15.75 7.24,15.11 7.24,10.67 8.25,9.65 R14.1 ; U2.14 28.31,22.75 27.92,22.35 v1(27.69,22.35)
  Bottom Layer w0.203: v1(27.69,22.35) 27.69,22.96 27.28,23.37 26.67,23.37 21.08,17.78 v1(14.1,17.78)
SPI_MISO: length 26
  Top Layer w0.203: v1(17.15,19.81) 11.81,14.48 U3.2 ; 29.25,23.75 v1(27.81,23.75)
  Bottom Layer w0.203: v1(27.81,23.75) 27.81,24.51 27.4,24.92 26.57,24.92 26.03,24.38 26.03,23.75 22.99,20.7 22.99,20.7 22.1,19.81 v1(17.15,19.81)
SPI_MOSI: length 21.2
  Top Layer w0.203: v1(27.05,24.26) 27.43,24.64 28.08,24.64 28.46,24.26 29.24,24.26 U2.17 ; U3.5 17.15,11.94 18.42,13.21 18.42,17.53 v1(20.07,19.18)
  Bottom Layer w0.203: v1(20.07,19.18) 21.97,19.18 v1(27.05,24.26)
SWIN: length 22.6
  Top Layer w0.203: R9.1 18.8,22.99 v1(19.3,23.5) 19.56,23.75 U2.45 ; 35.52,29.6 35.52,27.44 34.83,26.75 U2.22 27.64,26.75 v1(27.18,26.29)
  Bottom Layer w0.203: v1(27.18,26.29) 26.8,26.29 24.5,23.99 19.8,23.99 v1(19.3,23.5)
SWIN_DAP: length 27.4
  Top Layer w0.203: R13.1 v1(38.47,29.6)
  Bottom Layer w0.203: 43.73,16.11 44.3,16.11 45.59,17.4 46.99,17.4 47.9,18.31 47.9,29.18 46.99,30.1 39.75,30.1 39.25,29.6 v1(38.47,29.6)
SWIN_RST_DAP: length 34.9
  Top Layer w0.203: R12.1 v1(18.47,30.43)
  Bottom Layer w0.203: v1(18.47,30.43) 23.5,25.4 24.26,25.4 26.16,27.31 27.56,27.31 30.23,24.64 41.02,24.64 42.45,23.21 42.45,19.9 43.71,18.65 43.73,18.65
TCK: length 29.4
  Top Layer w0.203: U2.37 21.53,27.75 22.99,26.29 v1(23.75,26.29)
  Bottom Layer w0.203: v1(23.75,26.29) 25.15,27.69 27.81,27.69 30.51,24.99 35.53,24.99 38.1,27.56 44.98,27.56 H2.10
TMS: length 26.5
  Top Layer w0.203: H2.4 45.06,32.69 40.43,32.69 38.35,30.61 30.61,30.61 27.81,27.81 24,27.81 23.25,28.57 U2.34
TX_DAP: length 19.8
  Top Layer w0.203: 43.73,21.19 43.64,21.19 R26.1 36.95,12.99 33.02,9.06 33.02,7.63 34.18,6.48 LED2.2
TX_RY: length 11.8
  Top Layer w0.203: 32.79,17.89 32.79,19.03 31.07,20.75 U2.12 ; 32.79,17.89 34.54,16.13 34.54,14.86 34.9,14.5 R26.2 ; 32.79,17.89 32.79,18.01
TXD: length 49.3
  Top Layer w0.203: H2.14 45.09,22.38 45.09,24.64 45.47,25.02 46.99,25.02 48.13,26.16 48.13,37.72 47.12,38.74 36.07,38.74 34.29,36.96 34.29,34.16 32.64,32.51 26.29,32.51 25.25,31.47 U2.30
USB+: length 36.4
  Top Layer w0.203: U2.33 23.75,30.23 23.5,30.48 21.72,30.48 20.7,31.5 15.62,31.5 13.34,29.21 R4.1 13.2,28.57 12.95,28.32 10.29,28.32 9.17,27.2 9.17,20.17 10.9,18.44 13.1,18.44 14.61,19.94 14.61,21.84 14.19,22.26 Q1.3
USB-: length 13.3
  Top Layer w0.203: U2.32 24.25,30.35 23.67,30.94 21.9,30.94 20.96,31.88 14.86,31.88 13.72,30.73 R5.1
USB_RENUM: length 16.5
  Top Layer w0.203: U2.38 19.99,27.25 19.56,27.69 19.56,30.35 18.92,30.99 16.13,30.99 14.48,29.34 14.48,25.91 13.97,25.4 R2.1 R3.1
$1N17432: length 3.7
  Top Layer w0.203: Q2.1 4.1,39.28 3.68,38.86 2.54,38.86 2.17,38.49 R28.2
$1N18058: length 6.2
  Top Layer w0.203: BUZZER1.2 7.62,38.06 7.62,39.75 5.52,41.85 4.1,41.85
$1N29748: length 3.9
  Top Layer w0.203: Q1.1 11.36,23.55 R3.2
$1N30353: length 2.3
  Top Layer w0.203: R6.2 5.97,14.48 5.59,14.1 LED1.1
$1N32779: length 2
  Top Layer w0.203: R18.1 LED2.1
$1N32941: length 2
  Top Layer w0.203: R19.1 LED3.1
$1N52771: length 17.1
  Top Layer w0.203: Q1.2 13.27,19.12 12.95,18.8 11.05,18.8 9.53,20.32 9.53,26.92 10.54,27.94 12.95,27.94 13.2,27.69 R1.1

## Copper pours and planes (outline as drawn; the poured copper is in the pictures)
GND on Bottom Layer: 0,50 50,50 50,0 0,0

## Text on the board
Top Silkscreen Layer: RY- DAP V2.0
